# EAGLE design tinyGIANT (EAGLE 6.4)
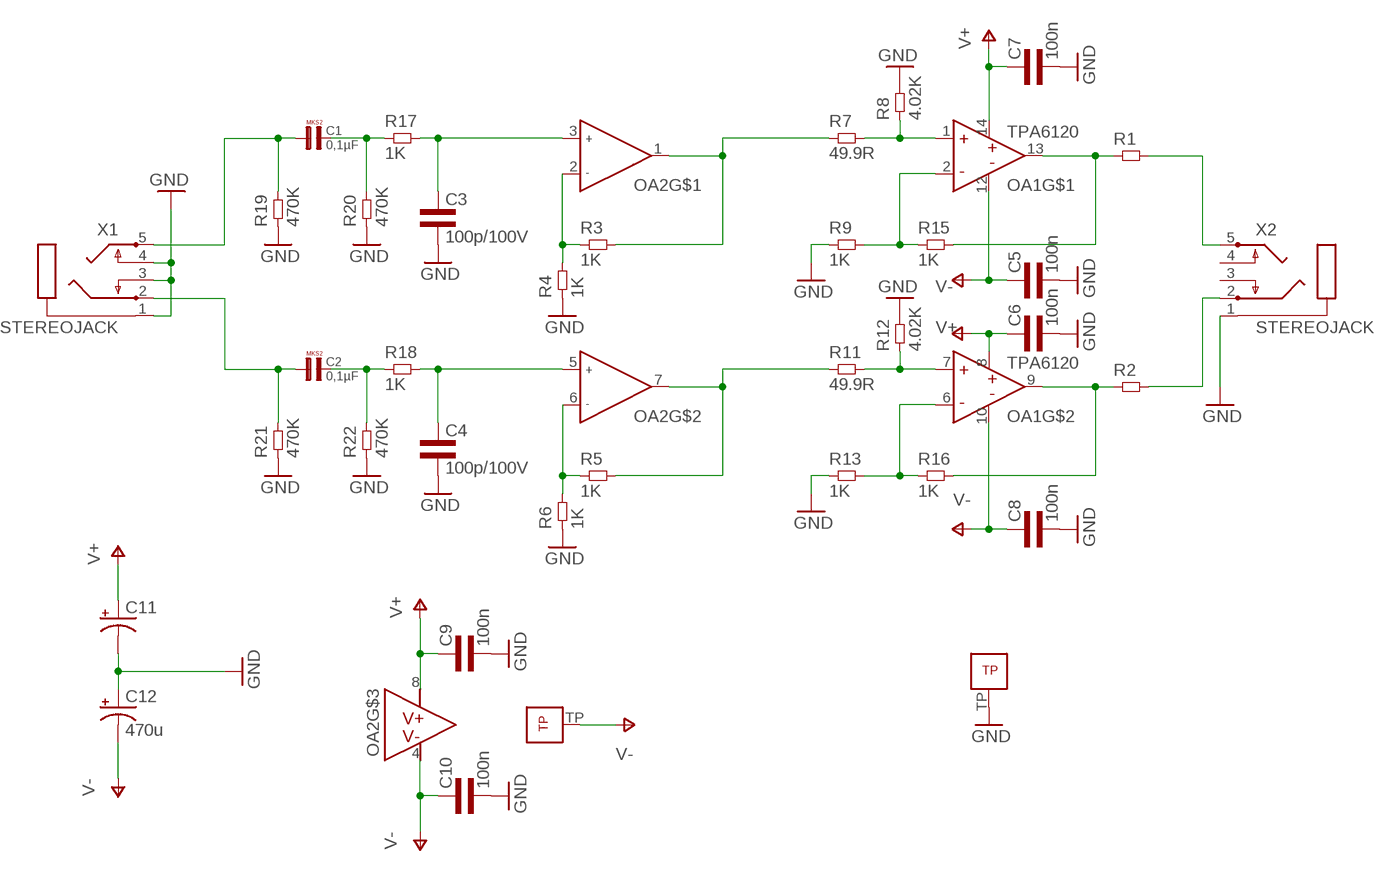
[diagram p0: schematic, sheet 1]

## Parts
C1  0,1µF  [R5B2K5]
C2  0,1µF  [R5B2K5]
C3  100p/100V  CAP0805L3  [0805L3]
C4  100p/100V  CAP0805L3  [0805L3]
C5  100n  CAP0603L3  [0603L3]
C6  100n  CAP0603L3  [0603L3]
C7  100n  CAP0603L3  [0603L3]
C8  100n  CAP0603L3  [0603L3]
C9  100n  CAP0603L3  [0603L3]
C10  100n  CAP0603L3  [0603L3]
C11  CPOL-USCT7343  [CT7343]
C12  470u  CPOL-USCT7343  [CT7343]
OA1  TPA6120QFN  [S-PVQFN-N14]
OA2  OPA1612  [S-PWSON-N8]
R1  RES1206L3  [1206L3]
R2  RES1206L3  [1206L3]
R3  1K  RES0603L3  [0603L3]
R4  1K  RES0603L3  [0603L3]
R5  1K  RES0603L3  [0603L3]
R6  1K  RES0603L3  [0603L3]
R7  49.9R  RES0805L3  [0805L3]
R8  4.02K  RES0805L3  [0805L3]
R9  1K  RES0603L3  [0603L3]
R11  49.9R  RES0805L3  [0805L3]
R12  4.02K  RES0805L3  [0805L3]
R13  1K  RES0603L3  [0603L3]
R15  1K  RES0603L3  [0603L3]
R16  1K  RES0603L3  [0603L3]
R17  1K  RES0805L3  [0805L3]
R18  1K  RES0805L3  [0805L3]
R19  470K  RES0805L3  [0805L3]
R20  470K  RES0805L3  [0805L3]
R21  470K  RES0805L3  [0805L3]
R22  470K  RES0805L3  [0805L3]
X1  STEREOJACK  [STX3100]
X2  STEREOJACK  [STX3100]

## Nets
BUF_IN_L: OA1.1(IN+) R7.2 R8.1
BUF_IN_R: OA1.7(IN+) R11.2 R12.1
BUF_INV_L: OA1.2(IN-) R9.P$2 R15.P$1
BUF_INV_R: OA1.6(IN-) R13.P$2 R16.P$1
BUF_OUT_L: OA1.13(OUT) R1.1 R15.P$2
BUF_OUT_R: OA1.9(OUT) R2.1 R16.P$2
CAP_OUT_L: C1.2 R17.1 R20.2
CAP_OUT_R: C2.2 R18.1 R22.2
GND: C3.2 C4.2 C5.P$2 C6.P$2 C7.P$2 C8.P$2 C9.P$2 C10.P$2 C11.- C12.+ OA1.TP R4.P$1 R6.P$1 R8.2 R9.P$1 R12.2 R13.P$1 R19.1 R20.1 R21.1 R22.1 X1.1 X1.3 X1.4 X2.1
HP_IN_L: C1.1 R19.2 X1.5
HP_IN_R: C2.1 R21.2 X1.2
HP_OUT_L: R1.2 X2.5
HP_OUT_R: R2.2 X2.2
OA_IN_L: C3.1 OA2.3(INA+) R17.2
OA_IN_R: C4.1 OA2.5(INB+) R18.2
OA_INV_L: OA2.2(INA-) R3.P$1 R4.P$2
OA_INV_R: OA2.6(INB-) R5.P$1 R6.P$2
OA_OUT_L: OA2.1(OUTA) R3.P$2 R7.1
OA_OUT_R: OA2.7(OUTB) R5.P$2 R11.1
V+: C6.P$1 C7.P$1 C9.P$1 C11.+ OA1.8(V+) OA1.14(V+) OA2.8(V+)
V-: C5.P$1 C8.P$1 C10.P$1 C12.- OA1.10(V-) OA1.12(V-) OA2.4(V-) OA2.TP
Unconnected: X2.3 X2.4

## Library data of the parts
C1 C2 = Capacitor-Wima-MKS2-63v:0,1µF
C3-C10 = common:CAP
C11 C12 = rcl:CPOL-US: POLARIZED CAPACITOR, American symbol
OA1 = common:TPA6120
OA2 = common:OPA1612
R1-R9 R11-R13 R15-R22 = common:RES
X1 X2 = adafruit:STEREOJACK: MIC/HEADPHONE JACK Stereo jack with two switches. Kycon STX3100, CUI SJ1-3555NG and/or 4UCon 05544

## Board
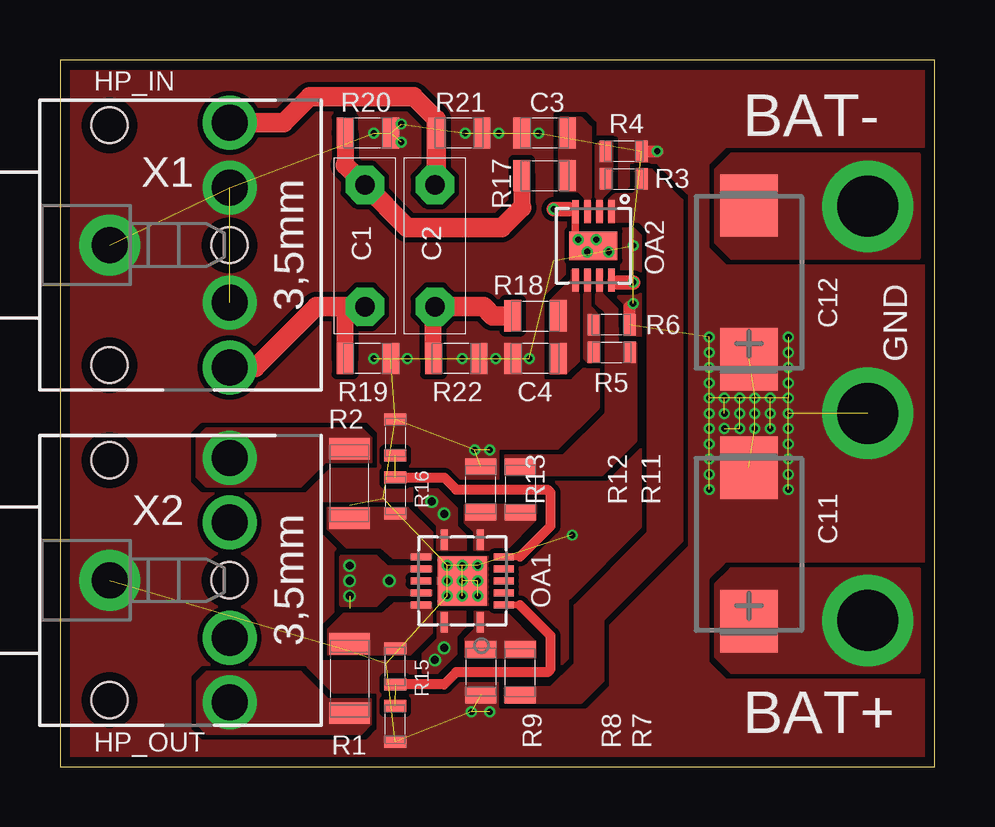
[diagram p1: board, top side]
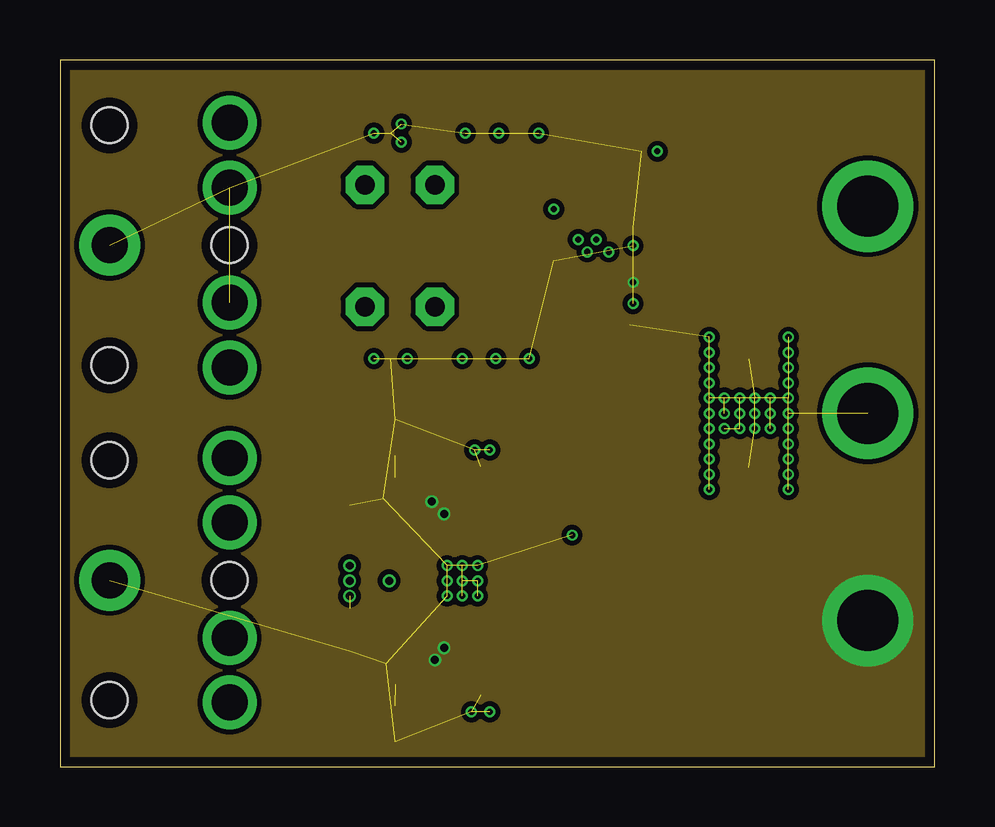
[diagram p2: board, inner layer Route2]
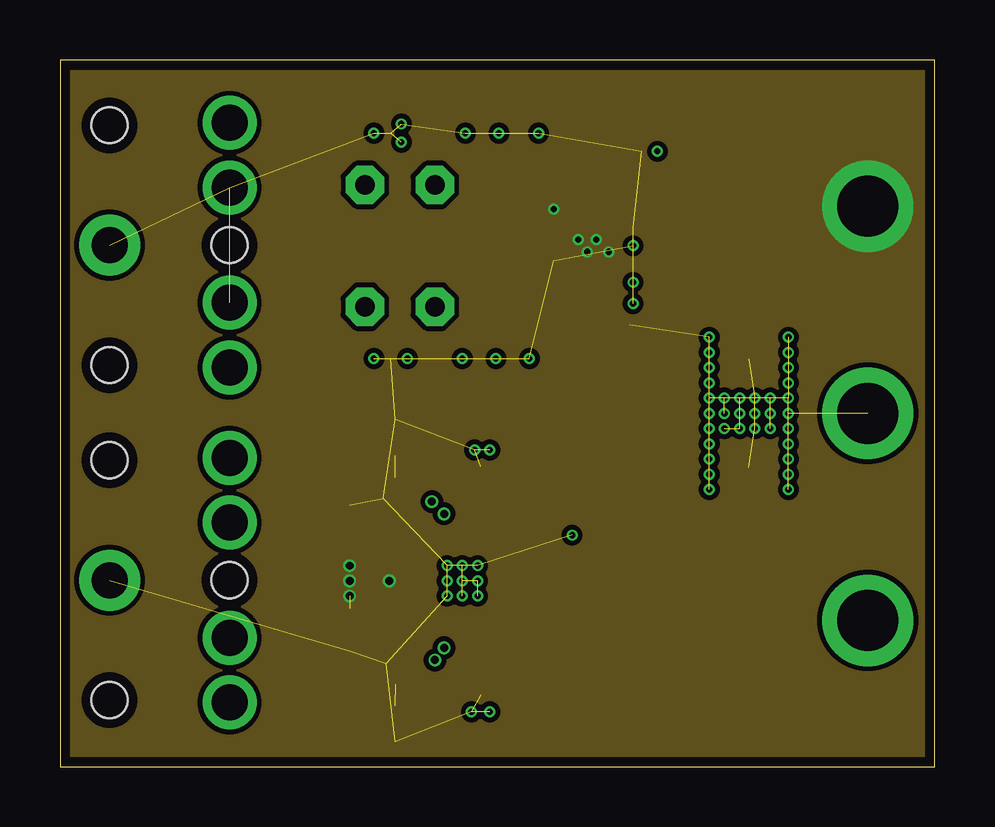
[diagram p3: board, inner layer Route3]
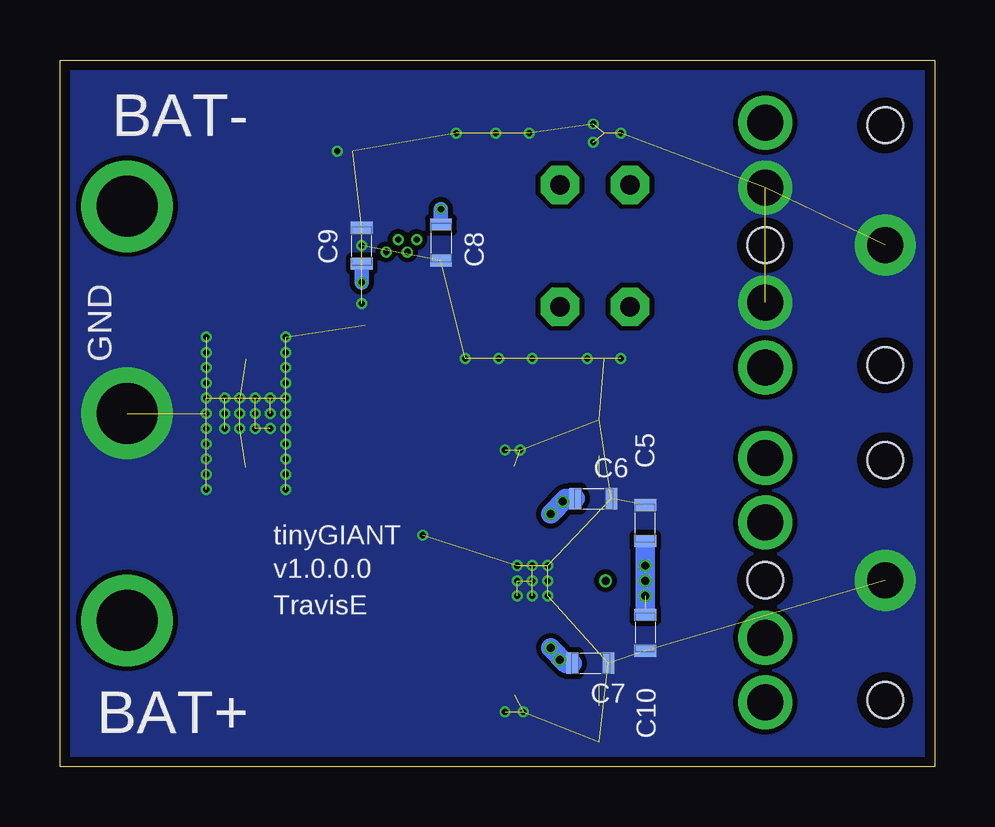
[diagram p4: board, bottom side, seen from below]

Size 36.45 x 29.46 mm. Coordinates in mm from the lower left corner, seen from the top.
Outline: 0,0 36.45,0 36.45,29.46 0,29.46 0,0
Copper layers (1*2*3*16): Top 0.035mm / dielectric 1.5mm / Route2 0.035mm / dielectric 0.15mm / Route3 0.035mm / dielectric 0.2mm / Bottom 0.035mm
Design rules "default *": minimum track width 5mil, minimum drill 10mil, track to track 8mil, track to pad 5mil, pad to pad 5mil, via to via 5mil, smd to smd 5mil, copper to edge 16mil, drill to drill 8mil, minimum pad ring 4mil, minimum via ring 4mil, stop-mask expansion 2mil, vias tented up to drill 16mil, thermal gap 10mil

### Footprints (pad centres in the part's own frame; a part is rotated, then mirrored left to right if it is on the bottom)
R5B2K5 = drill 0.813 pad 1.6 octagon: 1 -2.54,0; 2 2.54,0
0805L3 = smd 0.7 x 1.3: 1 -0.95,0; 2 0.95,0
0603L3 = smd 0.5 x 0.9: P$1 -0.75,0; P$2 0.75,0
CT7343 = smd 2.6 x 2.4: + -3.2,0; - 3.2,0
S-PVQFN-N14 = smd 0.85 x 0.28: 1 -1.725,-0.75; 7 1.725,-0.75; 8 1.725,0.75; 14 -1.725,0.75 | smd 0.28 x 0.85: 2 -1,-1.725; 3 -0.5,-1.725; 4 0,-1.725; 5 0.5,-1.725; 6 1,-1.725; 9 1,1.725; 10 0.5,1.725; 11 0,1.725; 12 -0.5,1.725; 13 -1,1.725 | smd 2.05 x 2.05: TP 0,0
S-PWSON-N8 = smd 0.28 x 0.95: 1 -0.75,-1.425; 2 -0.25,-1.425; 3 0.25,-1.425; 4 0.75,-1.425; 5 0.75,1.425; 6 0.25,1.425; 7 -0.25,1.425; 8 -0.75,1.425 | smd 2 x 1.2: TP 0,0
1206L3 = smd 0.9 x 1.7: 1 -1.45,0; 2 1.45,0
STX3100 = drill 1.5 pad 2.54: 1 2.7,-0.1 | drill 1.5: 2 7.7,5; 3 7.7,2.3; 4 7.7,-2.5; 5 7.7,-5.2 | hole 1.5: 2.7,4.9; 2.7,-5.1; 7.7,-0.1

### Placement (x,y rotation side)
C1  12.7,21.72 90 top
C2  15.62,21.72 270 top
C3  20.19,26.42 180 top
C4  19.81,17.02 180 top
C5  12.06,10.16 90 bottom
C6  14.22,11.18 0 bottom
C7  14.35,4.32 0 bottom
C8  20.57,21.84 270 bottom
C9  23.88,21.72 90 bottom
C10  12.06,5.59 270 bottom
C11  28.7,9.27 90 top
C12  28.7,20.19 90 top
OA1  16.76,7.75 90 top
OA2  22.23,21.72 180 top
R1  12.06,3.68 270 top
R2  12.06,11.81 90 top
R3  23.5,24.51 0 top
R4  23.5,25.65 180 top
R5  22.99,17.27 0 top
R6  22.99,18.41 180 top
R7  19.18,3.94 90 top
R8  17.53,3.94 270 top
R9  13.97,1.78 90 top
R11  19.18,11.56 270 top
R12  17.53,11.56 90 top
R13  13.97,13.72 270 top
R15  13.97,4.19 90 top
R16  13.97,11.3 270 top
R17  20.19,24.64 0 top
R18  19.81,18.8 0 top
R19  12.83,17.02 180 top
R20  12.83,26.42 180 top
R21  16.64,26.42 180 top
R22  16.51,17.02 180 top
X1  -0.64,21.84 0 top
X2  -0.64,7.87 0 top

### Tracks (layer width: path | path; a pad name or v marks a point on that pad's centre or on a via)
BUF_IN_L
  pour Top (no thermals): 17.27,6.48 17.27,5.72 16.89,5.33 16.89,4.57 19.81,4.57 19.81,5.21 18.54,6.48
BUF_IN_R
  pour Top (no thermals): 17.27,9.02 17.27,9.78 16.89,10.16 16.89,10.92 19.81,10.92 19.81,10.29 18.54,9.02
BUF_INV_L  (1 unrouted)
  Top 0.254: 19.16,6.75 19.18,6.73
  Top 0.279: OA1.2 19.16,6.75
  Top 0.406: R15.P$1 13.98,3.43 16,3.43 16.51,3.94 20.32,3.94 20.45,4.06 20.45,5.46 19.18,6.73
BUF_INV_R  (1 unrouted)
  Top 0.254: 19.16,8.75 19.18,8.76
  Top 0.279: OA1.6 19.16,8.75
  Top 0.406: R16.P$1 16.01,12.05 16.51,11.56 20.32,11.56 20.45,11.43 20.45,10.03 19.18,8.76
BUF_OUT_L
  pour Top (no thermals): 15.49,6.79 13.91,6.79 13.4,6.35 11.81,6.35 11.18,5.72 11.18,4.7 14.61,4.7 15.49,5.59
BUF_OUT_R
  pour Top (no thermals): 15.49,8.7 13.91,8.7 13.4,9.14 11.94,9.14 11.18,9.91 11.18,10.79 14.48,10.79 15.49,9.78
CAP_OUT_L
  Top 0.711: R20.2 11.88,25.08 | R17.1 19.24,23.31
  Top 0.813: 11.88,25.08 C1.2 14.48,22.48 18.41,22.48 19.24,23.31
CAP_OUT_R
  Top 0.61: 18.67,18.8 R18.1
  Top 0.711: R22.2 15.56,19.12
  Top 0.813: 15.56,19.12 C2.2 17.65,19.18 18.03,18.8 18.67,18.8
GND  (via drill 0.25, 2.54)  (84 unrouted)
  Top 0.406: 23.74,19.16 v23.88,19.3
  Top 0.508: R6.P$1 23.74,19.16 | R4.P$1 v24.89,25.65
  other vias: 13.08,26.42 14.22,26.8 16.89,26.42 18.29,26.42 19.94,26.42 13.08,17.02 14.48,17.02 16.76,17.02 18.16,17.02 19.56,17.02 17.27,13.21 17.91,13.21 17.14,2.29 17.91,2.29 16.76,7.75 16.13,8.38 16.76,8.38 17.4,8.38 16.13,7.75 17.4,7.75 17.4,7.11 16.76,7.11 16.13,7.11 27.05,17.91 27.05,17.27 27.05,16.64 27.05,16 27.05,15.37 27.05,14.73 27.05,14.1 27.05,13.46 27.05,12.83 27.05,12.19 27.05,11.56 30.35,17.91 30.35,17.27 30.35,16.64 30.35,16 30.35,15.37 30.35,14.73 30.35,14.1 30.35,13.46 30.35,12.83 30.35,12.19 30.35,11.56 27.69,15.37 28.32,15.37 28.96,15.37 29.59,15.37 27.69,14.73 28.32,14.73 28.96,14.73 29.59,14.73 29.59,14.1 28.96,14.1 28.32,14.1 27.69,14.1 33.66,14.73 14.22,26.04 21.34,9.65 23.88,21.72
  pour Bottom (rank 6, no thermals): 0.25,29.21 36.2,29.21 36.2,0.25 0.25,0.25
  pour Top (no thermals): 13.72,27.05 12.7,27.05 12.7,25.78 14.86,25.78 14.86,26.8 14.61,27.05
  pour Top (no thermals): 16.51,27.05 16.51,25.78 18.67,25.78 18.67,27.05
  pour Top (no thermals): 18.03,27.05 20.32,27.05 20.32,25.78 18.03,25.78
  pour Top (no thermals): 12.7,17.65 14.86,17.65 14.86,16.38 12.7,16.38
  pour Top (no thermals): 16.38,17.65 19.94,17.65 19.94,16.38 16.38,16.38
  pour Top (no thermals): 16.89,12.19 16.89,13.59 18.16,13.59 18.16,12.19
  pour Top (no thermals): 16.89,3.3 18.16,3.3 18.16,1.91 16.89,1.91
  pour Top (no thermals): 26.54,18.29 30.86,18.29 30.86,11.18 26.54,11.18
  pour Top (rank 6, no thermals): 0.25,29.21 36.2,29.21 36.2,0.25 0.25,0.25
HP_IN_L
  Top 0.711: R19.2 11.88,19.12
  Top 0.813: X1.5 8.13,16.64 10.67,19.18 11.94,19.18 | 11.94,19.18 C1.1 | 11.88,19.12 11.94,19.18
HP_IN_R
  Top 0.813: X1.2 9.32,26.84 10.41,27.94 14.73,27.94 15.69,26.98 R21.2 15.69,24.32 C2.1
HP_OUT_L
  pour Top (no thermals): 6.1,1.4 12.57,1.4 12.95,1.78 12.95,2.79 11.18,2.79 10.03,3.94 6.1,3.94 5.71,3.56 5.71,1.78
HP_OUT_R
  pour Top (no thermals): 6.1,14.1 12.57,14.1 12.95,13.72 12.95,12.7 11.05,12.7 10.03,11.68 6.1,11.68 5.71,12.06 5.71,13.72
OA_IN_L
  pour Top (no thermals): 21.84,22.73 21.84,23.75 21.59,24 20.83,24 20.83,27.05 21.72,27.05 22.1,26.67 22.1,22.73
OA_IN_R
  pour Top (no thermals): 21.59,20.7 21.59,16.89 21.08,16.38 20.45,16.38 20.45,19.43 21.34,20.32 21.34,20.7
OA_INV_L
  pour Top (no thermals): 22.35,22.73 22.35,25.91 22.48,26.04 22.99,26.04 22.99,24.13 22.61,23.75 22.61,22.73
OA_INV_R
  pour Top (no thermals): 21.84,20.7 21.84,17.02 21.97,16.89 22.48,16.89 22.48,18.8 22.1,19.18 22.1,20.7
OA_OUT_L
  pour Top (no thermals): 22.86,23.62 23.11,23.88 23.88,23.88 24,24 24,24.89 24.51,24.89 24.51,23.11 24.13,22.73 22.86,22.73
  pour Top (no thermals): 18.54,3.3 20.45,3.3 21.46,4.32 21.46,6.73 24.51,9.78 24.51,22.35 24.13,22.73 24,22.73 24,24.89 24.64,24.89 25.91,23.62 25.91,9.4 22.61,6.1 22.61,3.56 21.72,2.67 18.54,2.67
OA_OUT_R
  pour Top (no thermals): 22.35,20.7 22.35,19.3 22.73,18.92 22.73,16.89 24,16.89 24,17.65 23.24,17.65 23.24,19.05 22.61,19.68 22.61,20.7
  pour Top (no thermals): 22.73,16.89 22.73,14.73 20.95,12.95 18.54,12.95 18.54,12.19 22.61,12.19 24,13.59 24,17.65 22.73,17.65
V+  (via drill 0.25, 0.33, 2.54)
  Top 0.305: OA1.14 | OA2.8 23.27,20.29 23.24,20.19
  Top 0.61: 23.24,20.19 v23.88,20.19
  Bottom 0.406: C9.P$1 23.88,20.83
  Bottom 0.61: 23.88,20.83 v23.88,20.19
  Bottom 0.813: C6.P$1 15.37,11.18 v16,10.54 | C7.P$1 15.37,4.32 v16,4.95
  other vias: 33.66,6.1 15.62,4.44 15.49,11.05
  pour Route2: 0.25,29.21 36.2,29.21 36.2,0.25 0.25,0.25
  pour Top (no thermals): 33.66,8.25 27.94,8.25 27.3,7.62 27.3,4.57 27.94,3.94 35.81,3.94 35.81,8.25
  pour Top (no thermals): 14.99,11.56 15.75,11.56 16.51,10.79 16.51,10.03 16.89,9.65 16.89,9.02 15.75,9.02 15.75,10.03 14.99,10.79
  pour Top (no thermals): 15.75,6.48 15.75,5.33 15.11,4.7 15.11,3.94 15.75,3.94 16.51,4.7 16.51,5.46 16.89,5.84 16.89,6.48
V-  (via drill 0.25, 0.33, 2.54)  (1 unrouted)
  Top 0.305: OA2.TP 21.59,21.72 21.48,21.83 OA2.4 21.31,23.14 21.21,23.24
  Top 0.61: 21.21,23.24 v20.57,23.24
  Bottom 0.305: 12.06,6.6 C10.P$1 | 12.06,9.14 C5.P$1
  Bottom 0.406: C8.P$1 20.57,22.73
  Bottom 0.61: 20.57,22.73 v20.57,23.24
  Bottom 0.813: 12.06,6.6 12.06,9.14
  other vias: 21.59,21.97 21.97,21.46 22.35,21.97 22.86,21.46 33.66,23.37 12.06,8.38 12.06,7.75 13.72,7.75 12.06,7.11
  pour Route3: 0.25,29.21 36.2,29.21 36.2,0.25 0.25,0.25
  pour Top (no thermals): 33.66,25.53 27.94,25.53 27.3,24.89 27.3,21.84 27.94,21.21 35.81,21.21 35.81,25.53
  pour Top (no thermals): 15.49,8.32 13.65,8.32 13.21,8.76 11.68,8.76 11.68,6.73 13.21,6.73 13.65,7.18 15.49,7.18

### Text on the board
tPlace: HP_IN | BAT- | GND | BAT+ | HP_OUT
bPlace: BAT- | GND | tinyGIANT | v1.0.0.0 | TravisE | BAT+